# Altium schematic sheet XC3S1500-4FG676C_PWRSETUP.SchDoc: XC3S1500-4FG676C POWER
size A4; Organization: Altium Limited.; Address1: Level 3, 12a Rodborough Rd; Address2: Frenchs Forest 2086; Address3: NSW; Address4: AUSTRALIA; DocumentNumber: 14; Revision: 6; SheetNumber: 14; SheetTotal: 64; PageSetup: Record=PageOptions|CenterHorizontal=True|CenterVertical=True|PrintScale=0.97|XCorrection=1.00|YCorrection=1.00|PrintKind=0|BorderSize=5000000|LeftOffset=0|BottomOffset=0|Orientation=2|PaperLength=1000|PaperWidth=1000|Scale=100|PaperSource=7|PrintQuality=-4|MediaType=1|DitherType=10|PaperKind=A4 (210 x 297 mm)|PrintScaleMode=1
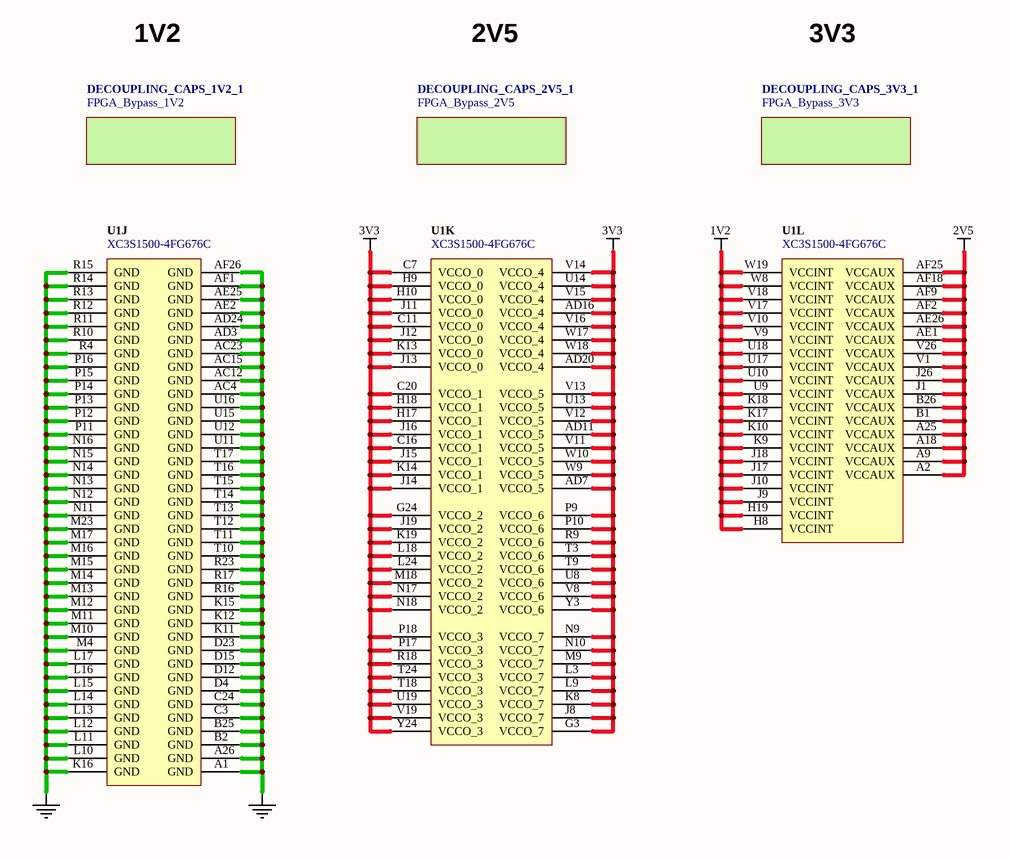
[diagram p0: XC3S1500-4FG676C_PWRSETUP.SchDoc]

## Parts
U1  XC3S1500-4FG676C  [BGA100P26X26-676]  (parts J,K,L of 12)

## Sub-sheets
DECOUPLING_CAPS_1V2_1 = FPGA_Bypass_1V2: no entries
DECOUPLING_CAPS_2V5_1 = FPGA_Bypass_2V5: no entries
DECOUPLING_CAPS_3V3_1 = FPGA_Bypass_3V3: no entries

## Nets
1V2: U1.H8(VCCINT) U1.H19(VCCINT) U1.J9(VCCINT) U1.J10(VCCINT) U1.J17(VCCINT) U1.J18(VCCINT) U1.K9(VCCINT) U1.K10(VCCINT) U1.K17(VCCINT) U1.K18(VCCINT) U1.U9(VCCINT) U1.U10(VCCINT) U1.U17(VCCINT) U1.U18(VCCINT) U1.V9(VCCINT) U1.V10(VCCINT) U1.V17(VCCINT) U1.V18(VCCINT) U1.W8(VCCINT) U1.W19(VCCINT)
2V5: U1.A2(VCCAUX) U1.A9(VCCAUX) U1.A18(VCCAUX) U1.A25(VCCAUX) U1.AE1(VCCAUX) U1.AE26(VCCAUX) U1.AF2(VCCAUX) U1.AF9(VCCAUX) U1.AF18(VCCAUX) U1.AF25(VCCAUX) U1.B1(VCCAUX) U1.B26(VCCAUX) U1.J1(VCCAUX) U1.J26(VCCAUX) U1.V1(VCCAUX) U1.V26(VCCAUX)
3V3: U1.AD7(VCCO_5) U1.AD11(VCCO_5) U1.AD16(VCCO_4) U1.AD20(VCCO_4) U1.C7(VCCO_0) U1.C11(VCCO_0) U1.C16(VCCO_1) U1.C20(VCCO_1) U1.G3(VCCO_7) U1.G24(VCCO_2) U1.H9(VCCO_0) U1.H10(VCCO_0) U1.H17(VCCO_1) U1.H18(VCCO_1) U1.J8(VCCO_7) U1.J11(VCCO_0) U1.J12(VCCO_0) U1.J13(VCCO_0) U1.J14(VCCO_1) U1.J15(VCCO_1) U1.J16(VCCO_1) U1.J19(VCCO_2) U1.K8(VCCO_7) U1.K13(VCCO_0) U1.K14(VCCO_1) U1.K19(VCCO_2) U1.L3(VCCO_7) U1.L9(VCCO_7) U1.L18(VCCO_2) U1.L24(VCCO_2) U1.M9(VCCO_7) U1.M18(VCCO_2) U1.N9(VCCO_7) U1.N10(VCCO_7) U1.N17(VCCO_2) U1.N18(VCCO_2) U1.P9(VCCO_6) U1.P10(VCCO_6) U1.P17(VCCO_3) U1.P18(VCCO_3) U1.R9(VCCO_6) U1.R18(VCCO_3) U1.T3(VCCO_6) U1.T9(VCCO_6) U1.T18(VCCO_3) U1.T24(VCCO_3) U1.U8(VCCO_6) U1.U13(VCCO_5) U1.U14(VCCO_4) U1.U19(VCCO_3) U1.V8(VCCO_6) U1.V11(VCCO_5) U1.V12(VCCO_5) U1.V13(VCCO_5) U1.V14(VCCO_4) U1.V15(VCCO_4) U1.V16(VCCO_4) U1.V19(VCCO_3) U1.W9(VCCO_5) U1.W10(VCCO_5) U1.W17(VCCO_4) U1.W18(VCCO_4) U1.Y3(VCCO_6) U1.Y24(VCCO_3)
GND: U1.A1(GND) U1.A26(GND) U1.AC4(GND) U1.AC12(GND) U1.AC15(GND) U1.AC23(GND) U1.AD3(GND) U1.AD24(GND) U1.AE2(GND) U1.AE25(GND) U1.AF1(GND) U1.AF26(GND) U1.B2(GND) U1.B25(GND) U1.C3(GND) U1.C24(GND) U1.D4(GND) U1.D12(GND) U1.D15(GND) U1.D23(GND) U1.K11(GND) U1.K12(GND) U1.K15(GND) U1.K16(GND) U1.L10(GND) U1.L11(GND) U1.L12(GND) U1.L13(GND) U1.L14(GND) U1.L15(GND) U1.L16(GND) U1.L17(GND) U1.M4(GND) U1.M10(GND) U1.M11(GND) U1.M12(GND) U1.M13(GND) U1.M14(GND) U1.M15(GND) U1.M16(GND) U1.M17(GND) U1.M23(GND) U1.N11(GND) U1.N12(GND) U1.N13(GND) U1.N14(GND) U1.N15(GND) U1.N16(GND) U1.P11(GND) U1.P12(GND) U1.P13(GND) U1.P14(GND) U1.P15(GND) U1.P16(GND) U1.R4(GND) U1.R10(GND) U1.R11(GND) U1.R12(GND) U1.R13(GND) U1.R14(GND) U1.R15(GND) U1.R16(GND) U1.R17(GND) U1.R23(GND) U1.T10(GND) U1.T11(GND) U1.T12(GND) U1.T13(GND) U1.T14(GND) U1.T15(GND) U1.T16(GND) U1.T17(GND) U1.U11(GND) U1.U12(GND) U1.U15(GND) U1.U16(GND)

## Notes on the sheet
- 1V2
- 2V5
- 3V3
- Sheet Title
- Project Title
- Size:
- Date:
- A4
- Assy:
- Time:
- Sheet
- Revision:
- of
- File:

## Library data of the parts
U1 = D-241-0001: FPGA, Xilinx Spartan3-1500 FG676 Speed=4; Supply Voltage: mV; Category: IC-FPGA; Mounting Technology: Surface Mount; Status: Production; Technology: None